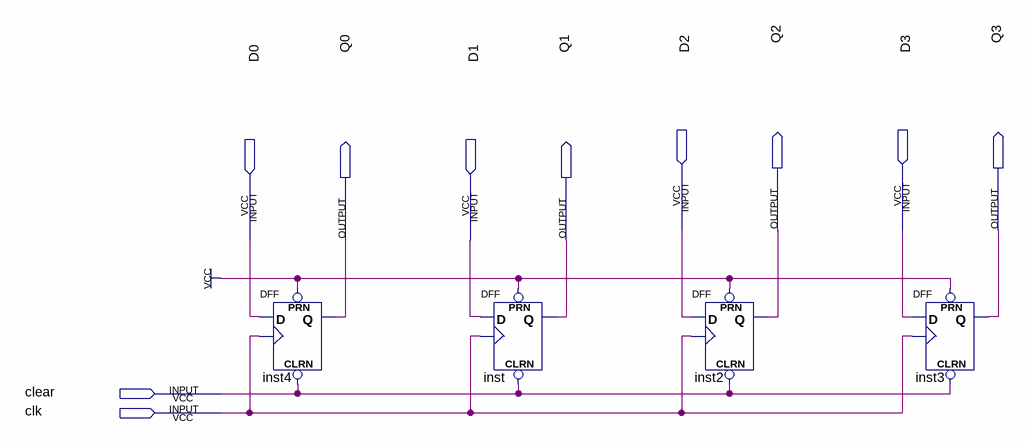
[diagram p0: schematic sheet]
// Quartus schematic parallel_register.bdf as structural Verilog: 4 symbols, 10 pins
module parallel_register (
  input  D2,
  input  D3,
  input  D0,
  input  D1,
  input  clear,
  input  clk,
  output Q2,
  output Q3,
  output Q0,
  output Q1
);

  DFF inst4 (.CLRN(clear), .CLK(clk), .D(D0), .PRN(1'b1), .Q(Q0));
  DFF inst (.CLRN(clear), .CLK(clk), .D(D1), .PRN(1'b1), .Q(Q1));
  DFF inst2 (.CLRN(clear), .CLK(clk), .D(D2), .PRN(1'b1), .Q(Q2));
  DFF inst3 (.CLRN(clear), .CLK(clk), .D(D3), .PRN(1'b1), .Q(Q3));
endmodule
